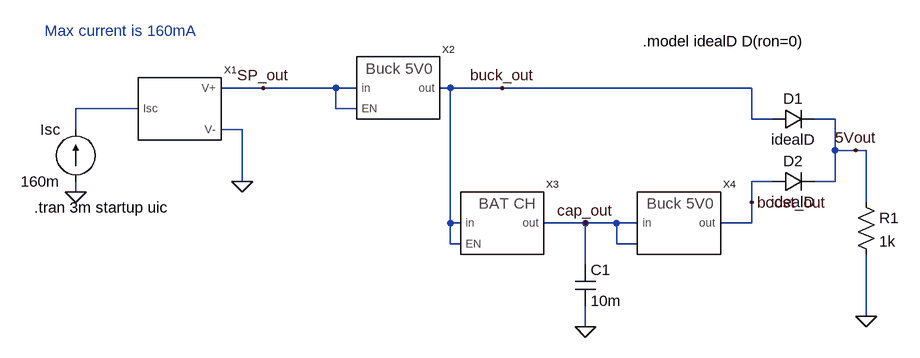
[diagram p0: schematic Complete_TestBench.asc]
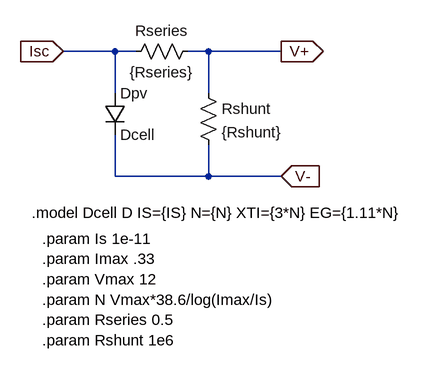
[diagram p1: sub-circuit solarcell.asc]
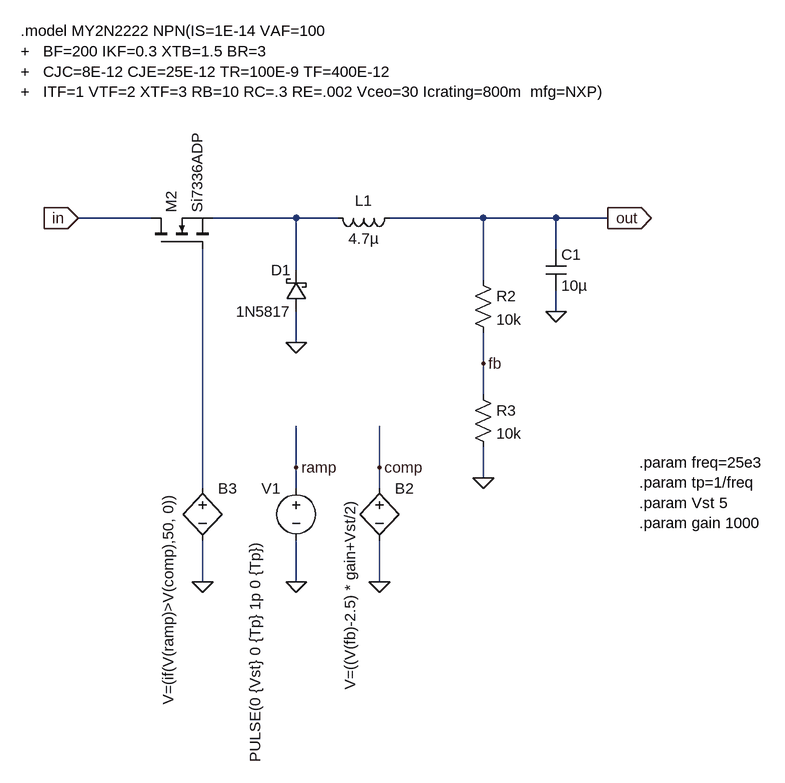
[diagram p2: sub-circuit 5v0_buck.asc]
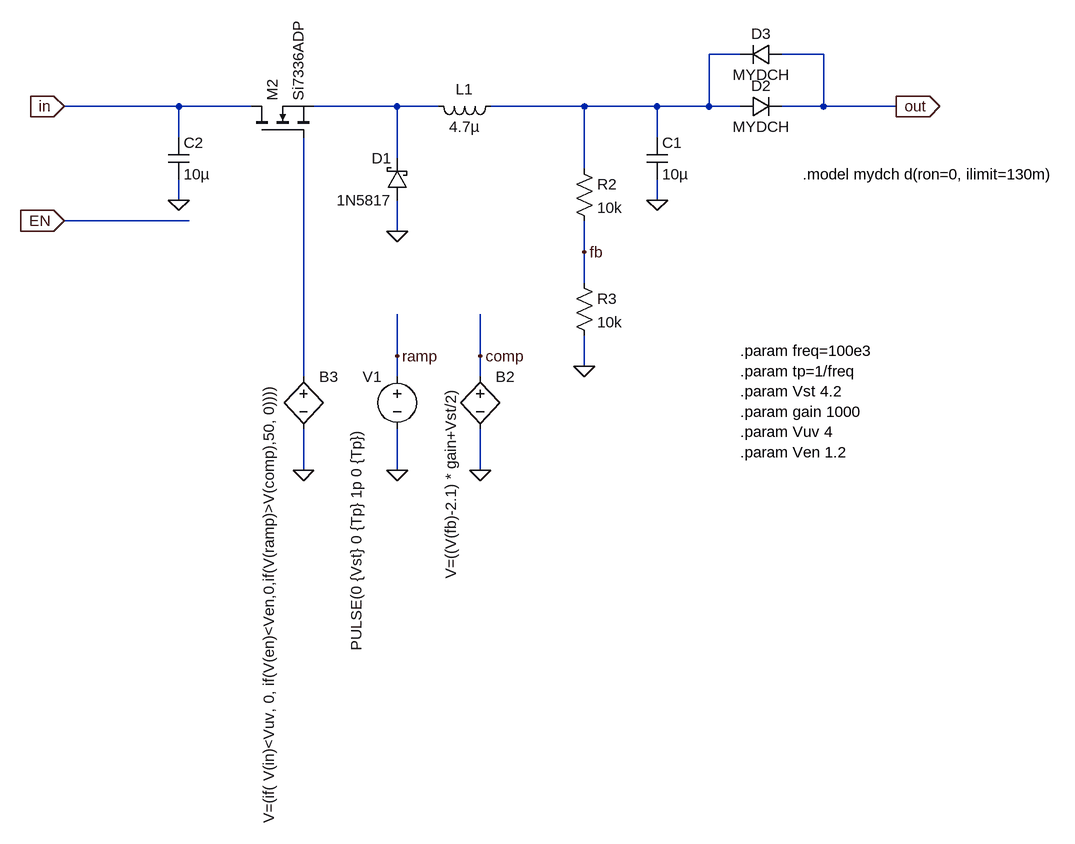
[diagram p3: sub-circuit bat_charger.asc]
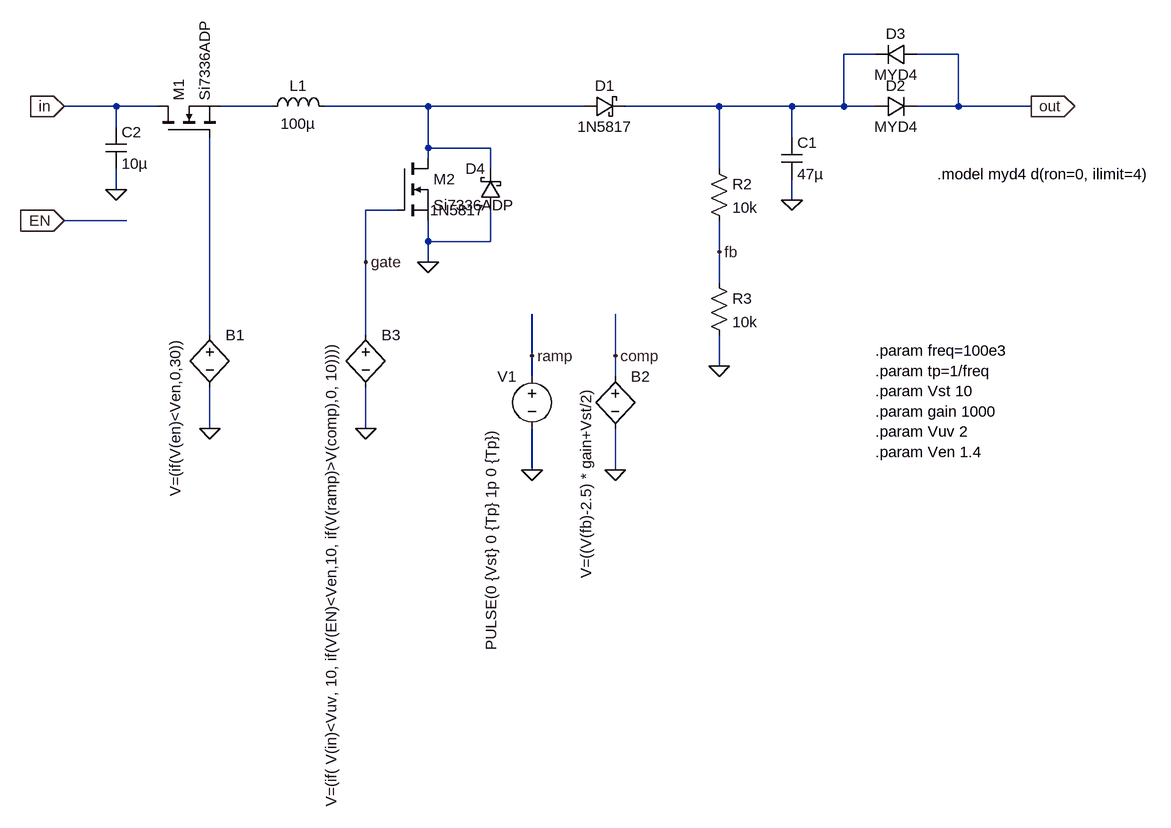
[diagram p4: sub-circuit 5v0_boost.asc]
Complete_TestBench.asc, the LTspice schematic file:
Version 4
SHEET 1 1288 680
WIRE 304 144 240 144
WIRE 416 144 304 144
WIRE 448 144 416 144
WIRE 592 144 576 144
WIRE 672 144 592 144
WIRE 1056 144 672 144
WIRE 112 176 16 176
WIRE 416 176 416 144
WIRE 448 176 416 176
WIRE 1056 192 1056 144
WIRE 1088 192 1056 192
WIRE 1184 192 1152 192
WIRE 16 208 16 176
WIRE 272 208 240 208
WIRE 1184 240 1184 192
WIRE 1216 240 1184 240
WIRE 1232 240 1216 240
WIRE 272 288 272 208
WIRE 1088 288 1056 288
WIRE 1184 288 1184 240
WIRE 1184 288 1152 288
WIRE 16 304 16 288
WIRE 1056 320 1056 288
WIRE 1232 320 1232 240
WIRE 592 352 592 144
WIRE 608 352 592 352
WIRE 800 352 736 352
WIRE 848 352 800 352
WIRE 880 352 848 352
WIRE 1056 352 1056 320
WIRE 1056 352 1008 352
WIRE 592 384 592 352
WIRE 608 384 592 384
WIRE 848 384 848 352
WIRE 880 384 848 384
WIRE 800 416 800 352
WIRE 1232 496 1232 400
WIRE 800 512 800 480
FLAG 272 288 0
FLAG 16 304 0
FLAG 304 144 SP_out
FLAG 800 512 0
FLAG 1216 240 5Vout
FLAG 1232 496 0
FLAG 672 144 buck_out
FLAG 1056 320 boost_out
FLAG 800 352 cap_out
SYMBOL SolarCell 176 176 R0
SYMATTR InstName X1
SYMBOL current 16 288 R180
WINDOW 0 24 80 Left 2
WINDOW 3 24 0 Left 2
WINDOW 123 0 0 Left 0
WINDOW 39 0 0 Left 0
SYMATTR InstName Isc
SYMATTR Value 160m
SYMBOL 5V0_BUCK 512 144 R0
SYMATTR InstName X2
SYMBOL BAT_CHARGER 672 352 R0
SYMATTR InstName X3
SYMBOL cap 784 416 R0
SYMATTR InstName C1
SYMATTR Value 10m
SYMBOL 5V0_BOOST 944 352 R0
SYMATTR InstName X4
SYMBOL diode 1088 208 R270
WINDOW 0 32 32 VTop 2
WINDOW 3 0 32 VBottom 2
SYMATTR InstName D1
SYMATTR Value idealD
SYMBOL diode 1088 304 R270
WINDOW 0 32 32 VTop 2
WINDOW 3 0 32 VBottom 2
SYMATTR InstName D2
SYMATTR Value idealD
SYMBOL res 1216 304 R0
SYMATTR InstName R1
SYMATTR Value 1k
TEXT -48 328 Left 2 !.tran 3m startup uic
TEXT -32 56 Left 2 ;Max current is 160mA
TEXT 888 72 Left 2 !.model idealD D(ron=0)

solarcell.asc, the sub-circuit schematic file:
Version 4
SHEET 1 1020 680
WIRE 304 112 224 112
WIRE 336 112 304 112
WIRE 448 112 416 112
WIRE 560 112 448 112
WIRE 304 176 304 112
WIRE 448 176 448 112
WIRE 304 304 304 240
WIRE 448 304 448 256
WIRE 448 304 304 304
WIRE 560 304 448 304
FLAG 224 112 Isc
IOPIN 224 112 In
FLAG 560 112 V+
IOPIN 560 112 Out
FLAG 560 304 V-
IOPIN 560 304 In
SYMBOL diode 288 176 R0
SYMATTR InstName Dpv
SYMATTR Value Dcell
SYMBOL res 432 160 R0
SYMATTR InstName Rshunt
SYMATTR Value {Rshunt}
SYMBOL res 432 96 R90
WINDOW 0 0 56 VBottom 2
WINDOW 3 32 56 VTop 2
SYMATTR InstName Rseries
SYMATTR Value {Rseries}
TEXT 176 360 Left 2 !.model Dcell D IS={IS} N={N} XTI={3*N} EG={1.11*N}
TEXT 192 400 Left 2 !.param Is 1e-11\n.param Imax .33\n.param Vmax 12\n.param N Vmax*38.6/log(Imax/Is)\n.param Rseries 0.5\n.param Rshunt 1e6

5v0_buck.asc, the sub-circuit schematic file:
Version 4
SHEET 1 920 1568
WIRE -48 128 -160 128
WIRE 176 128 48 128
WIRE 240 128 176 128
WIRE 464 128 320 128
WIRE 576 128 464 128
WIRE 656 128 576 128
WIRE 576 176 576 128
WIRE 176 208 176 128
WIRE 464 224 464 128
WIRE 576 272 576 240
WIRE 176 320 176 272
WIRE 464 352 464 304
WIRE 464 400 464 352
WIRE 176 512 176 448
WIRE 304 512 304 448
WIRE 464 528 464 480
WIRE 32 544 32 176
WIRE 176 544 176 512
WIRE 304 544 304 512
WIRE 32 688 32 624
WIRE 176 688 176 624
WIRE 304 688 304 624
FLAG 464 528 0
FLAG 464 352 fb
FLAG 656 128 out
IOPIN 656 128 Out
FLAG -160 128 in
IOPIN -160 128 In
FLAG 576 272 0
FLAG 176 320 0
FLAG 304 512 comp
FLAG 176 512 ramp
FLAG 32 688 0
FLAG 176 688 0
FLAG 304 688 0
SYMBOL res 448 208 R0
SYMATTR InstName R2
SYMATTR Value 10k
SYMBOL res 448 384 R0
SYMATTR InstName R3
SYMATTR Value 10k
SYMBOL cap 560 176 R0
SYMATTR InstName C1
SYMATTR Value 10µ
SYMBOL ind 336 112 R90
WINDOW 0 5 56 VBottom 2
WINDOW 3 32 56 VTop 2
SYMATTR InstName L1
SYMATTR Value 4.7µ
SYMATTR SpiceLine Rser=10m
SYMBOL schottky 192 272 R180
WINDOW 0 24 64 Left 2
WINDOW 3 24 0 Left 2
SYMATTR InstName D1
SYMATTR Value 1N5817
SYMATTR Description Diode
SYMATTR Type diode
SYMBOL bv 304 528 R0
WINDOW 3 -45 32 VRight 2
SYMATTR Value V=((V(fb)-2.5) * gain+Vst/2)
SYMATTR InstName B2
SYMBOL voltage 176 528 M0
WINDOW 3 63 438 VLeft 2
WINDOW 123 0 0 Left 0
WINDOW 39 0 0 Left 0
SYMATTR Value PULSE(0 {Vst} 0 {Tp} 1p 0 {Tp})
SYMATTR InstName V1
SYMBOL bv 32 528 R0
WINDOW 3 -53 20 VRight 2
SYMATTR Value V=(if(V(ramp)>V(comp),50, 0))
SYMATTR InstName B3
SYMBOL nmos -48 176 R270
SYMATTR InstName M2
SYMATTR Value Si7336ADP
TEXT -248 -160 Left 2 !.model MY2N2222 NPN(IS=1E-14 VAF=100\n+   BF=200 IKF=0.3 XTB=1.5 BR=3\n+   CJC=8E-12 CJE=25E-12 TR=100E-9 TF=400E-12\n+   ITF=1 VTF=2 XTF=3 RB=10 RC=.3 RE=.002 Vceo=30 Icrating=800m  mfg=NXP)
TEXT 704 504 Left 2 !.param freq=25e3\n.param tp=1/freq\n.param Vst 5\n.param gain 1000

bat_charger.asc, the sub-circuit schematic file:
Version 4
SHEET 1 1236 1568
WIRE 704 48 656 48
WIRE 832 48 768 48
WIRE -160 128 -336 128
WIRE -48 128 -160 128
WIRE 176 128 48 128
WIRE 240 128 176 128
WIRE 464 128 320 128
WIRE 576 128 464 128
WIRE 656 128 656 48
WIRE 656 128 576 128
WIRE 704 128 656 128
WIRE 832 128 832 48
WIRE 832 128 768 128
WIRE 944 128 832 128
WIRE -160 176 -160 128
WIRE 576 176 576 128
WIRE 176 208 176 128
WIRE 464 224 464 128
WIRE -160 272 -160 240
WIRE 576 272 576 240
WIRE -144 304 -336 304
WIRE 176 320 176 272
WIRE 464 352 464 304
WIRE 464 400 464 352
WIRE 176 512 176 448
WIRE 304 512 304 448
WIRE 464 528 464 480
WIRE 32 544 32 176
WIRE 176 544 176 512
WIRE 304 544 304 512
WIRE 32 688 32 624
WIRE 176 688 176 624
WIRE 304 688 304 624
FLAG 464 528 0
FLAG 464 352 fb
FLAG 944 128 out
IOPIN 944 128 Out
FLAG -336 128 in
IOPIN -336 128 In
FLAG 576 272 0
FLAG 176 320 0
FLAG 304 512 comp
FLAG 176 512 ramp
FLAG 32 688 0
FLAG 176 688 0
FLAG 304 688 0
FLAG -336 304 EN
IOPIN -336 304 In
FLAG -160 272 0
SYMBOL res 448 208 R0
SYMATTR InstName R2
SYMATTR Value 10k
SYMBOL res 448 384 R0
SYMATTR InstName R3
SYMATTR Value 10k
SYMBOL cap 560 176 R0
SYMATTR InstName C1
SYMATTR Value 10µ
SYMBOL ind 336 112 R90
WINDOW 0 5 56 VBottom 2
WINDOW 3 32 56 VTop 2
SYMATTR InstName L1
SYMATTR Value 4.7µ
SYMATTR SpiceLine Rser=30m
SYMBOL schottky 192 272 R180
WINDOW 0 24 64 Left 2
WINDOW 3 24 0 Left 2
SYMATTR InstName D1
SYMATTR Value 1N5817
SYMATTR Description Diode
SYMATTR Type diode
SYMBOL bv 304 528 R0
WINDOW 3 -45 32 VRight 2
SYMATTR Value V=((V(fb)-2.1) * gain+Vst/2)
SYMATTR InstName B2
SYMBOL voltage 176 528 M0
WINDOW 3 63 438 VLeft 2
WINDOW 123 0 0 Left 0
WINDOW 39 0 0 Left 0
SYMATTR Value PULSE(0 {Vst} 0 {Tp} 1p 0 {Tp})
SYMATTR InstName V1
SYMBOL bv 32 528 R0
WINDOW 3 -53 20 VRight 2
SYMATTR Value V=(if( V(in)<Vuv, 0, if(V(en)<Ven,0,if(V(ramp)>V(comp),50, 0))))
SYMATTR InstName B3
SYMBOL nmos -48 176 R270
SYMATTR InstName M2
SYMATTR Value Si7336ADP
SYMBOL diode 704 144 R270
WINDOW 0 32 32 VTop 2
WINDOW 3 0 32 VBottom 2
SYMATTR InstName D2
SYMATTR Value MYDCH
SYMBOL diode 768 32 R90
WINDOW 0 0 32 VBottom 2
WINDOW 3 32 32 VTop 2
SYMATTR InstName D3
SYMATTR Value MYDCH
SYMBOL cap -176 176 R0
SYMATTR InstName C2
SYMATTR Value 10µ
TEXT 704 504 Left 2 !.param freq=100e3\n.param tp=1/freq\n.param Vst 4.2\n.param gain 1000\n.param Vuv 4\n.param Ven 1.2
TEXT 800 232 Left 2 !.model mydch d(ron=0, ilimit=130m)

5v0_boost.asc, the sub-circuit schematic file:
Version 4
SHEET 1 1172 1568
WIRE 704 48 656 48
WIRE 832 48 768 48
WIRE -464 128 -544 128
WIRE -400 128 -464 128
WIRE -224 128 -304 128
WIRE 16 128 -144 128
WIRE 256 128 16 128
WIRE 464 128 320 128
WIRE 576 128 464 128
WIRE 656 128 656 48
WIRE 656 128 576 128
WIRE 704 128 656 128
WIRE 832 128 832 48
WIRE 832 128 768 128
WIRE 944 128 832 128
WIRE -464 160 -464 128
WIRE 576 176 576 128
WIRE 16 192 16 128
WIRE 112 192 16 192
WIRE 16 208 16 192
WIRE 112 224 112 192
WIRE 464 224 464 128
WIRE -464 256 -464 224
WIRE 576 272 576 240
WIRE -32 288 -80 288
WIRE -448 304 -544 304
WIRE 16 336 16 304
WIRE 112 336 112 288
WIRE 112 336 16 336
WIRE 464 352 464 304
WIRE -80 368 -80 288
WIRE 16 368 16 336
WIRE 464 400 464 352
WIRE -320 480 -320 176
WIRE -80 480 -80 368
WIRE 176 512 176 448
WIRE 304 512 304 448
WIRE 464 528 464 480
WIRE 176 544 176 512
WIRE 304 544 304 512
WIRE -320 624 -320 560
WIRE -80 624 -80 560
WIRE 176 688 176 624
WIRE 304 688 304 624
FLAG 464 528 0
FLAG 464 352 fb
FLAG 944 128 out
IOPIN 944 128 Out
FLAG -544 128 in
IOPIN -544 128 In
FLAG 576 272 0
FLAG 304 512 comp
FLAG 176 512 ramp
FLAG -80 624 0
FLAG 176 688 0
FLAG 304 688 0
FLAG -544 304 EN
IOPIN -544 304 In
FLAG 16 368 0
FLAG -80 368 gate
FLAG -320 624 0
FLAG -464 256 0
SYMBOL res 448 208 R0
SYMATTR InstName R2
SYMATTR Value 10k
SYMBOL res 448 384 R0
SYMATTR InstName R3
SYMATTR Value 10k
SYMBOL cap 560 176 R0
SYMATTR InstName C1
SYMATTR Value 47µ
SYMBOL ind -240 144 R270
WINDOW 0 32 56 VTop 2
WINDOW 3 5 56 VBottom 2
SYMATTR InstName L1
SYMATTR Value 100µ
SYMATTR SpiceLine Rser=30m
SYMBOL schottky 256 144 R270
WINDOW 0 32 32 VTop 2
WINDOW 3 0 32 VBottom 2
SYMATTR InstName D1
SYMATTR Value 1N5817
SYMATTR Description Diode
SYMATTR Type diode
SYMBOL bv 304 528 R0
WINDOW 3 -45 32 VRight 2
SYMATTR Value V=((V(fb)-2.5) * gain+Vst/2)
SYMATTR InstName B2
SYMBOL voltage 176 528 M0
WINDOW 3 63 438 VLeft 2
WINDOW 123 0 0 Left 0
WINDOW 39 0 0 Left 0
SYMATTR Value PULSE(0 {Vst} 0 {Tp} 1p 0 {Tp})
SYMATTR InstName V1
SYMBOL bv -80 464 R0
WINDOW 3 -53 20 VRight 2
SYMATTR Value V=(if( V(in)<Vuv, 10, if(V(EN)<Ven,10, if(V(ramp)>V(comp),0, 10))))
SYMATTR InstName B3
SYMBOL nmos -32 208 R0
SYMATTR InstName M2
SYMATTR Value Si7336ADP
SYMBOL diode 704 144 R270
WINDOW 0 32 32 VTop 2
WINDOW 3 0 32 VBottom 2
SYMATTR InstName D2
SYMATTR Value MYD4
SYMBOL diode 768 32 R90
WINDOW 0 0 32 VBottom 2
WINDOW 3 32 32 VTop 2
SYMATTR InstName D3
SYMATTR Value MYD4
SYMBOL nmos -400 176 R270
SYMATTR InstName M1
SYMATTR Value Si7336ADP
SYMBOL bv -320 464 R0
WINDOW 3 -53 20 VRight 2
SYMATTR Value V=(if(V(en)<Ven,0,30))
SYMATTR InstName B1
SYMBOL schottky 128 288 R180
WINDOW 0 24 64 Left 2
WINDOW 3 24 0 Left 2
SYMATTR InstName D4
SYMATTR Value 1N5817
SYMATTR Description Diode
SYMATTR Type diode
SYMBOL cap -480 160 R0
SYMATTR InstName C2
SYMATTR Value 10µ
TEXT 704 504 Left 2 !.param freq=100e3\n.param tp=1/freq\n.param Vst 10\n.param gain 1000\n.param Vuv 2\n.param Ven 1.4
TEXT 800 232 Left 2 !.model myd4 d(ron=0, ilimit=4)

The netlist it stands for:
* Complete_TestBench.asc
XX1 N001 SP_out 0 solarcell
Isc 0 N001 160m
XX2 SP_out buck_out SP_out 5v0_buck
XX3 buck_out cap_out buck_out bat_charger
C1 cap_out 0 10m
XX4 cap_out boost_out 5v0_boost
D1 buck_out 5Vout idealD
D2 boost_out 5Vout idealD
R1 5Vout 0 1k

* block symbol definitions
.subckt solarcell Isc V+ V-
Dpv Isc V- Dcell
Rshunt V+ V- {Rshunt}
Rseries V+ Isc {Rseries}
.model Dcell D IS={IS} N={N} XTI={3*N} EG={1.11*N}
.param Is 1e-11
.param Imax .33
.param Vmax 12
.param N Vmax*38.6/log(Imax/Is)
.param Rseries 0.5
.param Rshunt 1e6
.ends solarcell

.subckt 5v0_buck in out EN
R2 out fb 10k
R3 fb 0 10k
C1 out 0 10µ
L1 out N001 4.7µ Rser=10m
D1 0 N001 1N5817
B2 comp 0 V=((V(fb)-2.5) * gain+Vst/2)
V1 ramp 0 PULSE(0 {Vst} 0 {Tp} 1p 0 {Tp})
B3 N002 0 V=(if(V(ramp)>V(comp),50, 0))
M2 in N002 N001 N001 Si7336ADP
.model MY2N2222 NPN(IS=1E-14 VAF=100
+   BF=200 IKF=0.3 XTB=1.5 BR=3
+   CJC=8E-12 CJE=25E-12 TR=100E-9 TF=400E-12
+   ITF=1 VTF=2 XTF=3 RB=10 RC=.3 RE=.002 Vceo=30 Icrating=800m  mfg=NXP)
.param freq=25e3
.param tp=1/freq
.param Vst 5
.param gain 1000
.ends 5v0_buck

.subckt bat_charger in out EN
R2 N001 fb 10k
R3 fb 0 10k
C1 N001 0 10µ
L1 N001 N002 4.7µ Rser=30m
D1 0 N002 1N5817
B2 comp 0 V=((V(fb)-2.1) * gain+Vst/2)
V1 ramp 0 PULSE(0 {Vst} 0 {Tp} 1p 0 {Tp})
B3 N003 0 V=(if( V(in)<Vuv, 0, if(V(en)<Ven,0,if(V(ramp)>V(comp),50, 0))))
M2 in N003 N002 N002 Si7336ADP
D2 N001 out MYDCH
D3 out N001 MYDCH
C2 in 0 10µ
.param freq=100e3
.param tp=1/freq
.param Vst 4.2
.param gain 1000
.param Vuv 4
.param Ven 1.2
.model mydch d(ron=0, ilimit=130m)
.ends bat_charger

.subckt 5v0_boost in out
R2 N001 fb 10k
R3 fb 0 10k
C1 N001 0 47µ
L1 N002 N003 100µ Rser=30m
D1 N003 N001 1N5817
B2 comp 0 V=((V(fb)-2.5) * gain+Vst/2)
V1 ramp 0 PULSE(0 {Vst} 0 {Tp} 1p 0 {Tp})
B3 gate 0 V=(if( V(in)<Vuv, 10, if(V(EN)<Ven,10, if(V(ramp)>V(comp),0, 10))))
M2 N003 gate 0 0 Si7336ADP
D2 N001 out MYD4
D3 out N001 MYD4
M1 in N004 N002 N002 Si7336ADP
B1 N004 0 V=(if(V(en)<Ven,0,30))
D4 0 N003 1N5817
C2 in 0 10µ
.param freq=100e3
.param tp=1/freq
.param Vst 10
.param gain 1000
.param Vuv 2
.param Ven 1.4
.model myd4 d(ron=0, ilimit=4)
.ends 5v0_boost

.model D D
.lib standard.dio
.model NMOS NMOS
.model PMOS PMOS
.lib standard.mos
.tran 3m startup uic
* Max current is 160mA
.model idealD D(ron=0)
.backanno
.end